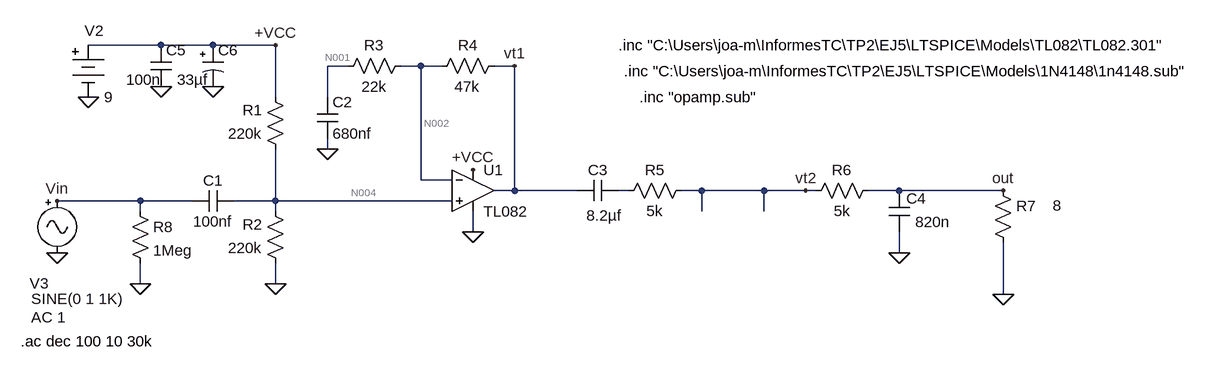
[diagram p0: schematic alternativa.asc]
alternativa.asc, the LTspice schematic file:
Version 4
SHEET 1 1528 680
WIRE -352 -80 -464 -80
WIRE -272 -80 -352 -80
WIRE -176 -80 -272 -80
WIRE -64 -48 -96 -48
WIRE 48 -48 16 -48
WIRE 80 -48 48 -48
WIRE 192 -48 160 -48
WIRE -176 0 -176 -80
WIRE -96 0 -96 -48
WIRE -96 80 -96 64
WIRE 48 128 48 -48
WIRE 96 128 48 128
WIRE 192 144 192 -48
WIRE 192 144 160 144
WIRE 288 144 192 144
WIRE 368 144 352 144
WIRE 480 144 448 144
WIRE 576 144 480 144
WIRE 640 144 576 144
WIRE 656 144 640 144
WIRE 784 144 736 144
WIRE 944 144 784 144
WIRE -384 160 -512 160
WIRE -304 160 -384 160
WIRE -176 160 -176 80
WIRE -176 160 -240 160
WIRE 96 160 -176 160
WIRE -384 176 -384 160
WIRE -176 176 -176 160
WIRE 480 176 480 144
WIRE 576 176 576 144
WIRE 128 208 128 176
WIRE 784 240 784 208
WIRE -384 288 -384 256
WIRE -176 288 -176 256
WIRE 944 304 944 224
FLAG -96 80 0
FLAG 784 240 0
FLAG 128 208 0
FLAG -176 288 0
FLAG -352 -16 0
FLAG -384 288 0
FLAG -512 240 0
FLAG -464 0 0
FLAG -512 160 Vin
FLAG -176 -80 +VCC
FLAG 128 112 +VCC
FLAG -272 -16 0
FLAG 192 -48 vt1
FLAG 640 144 vt2
FLAG 944 304 0
FLAG 944 144 out
SYMBOL res -160 96 R180
WINDOW 0 36 76 Left 2
WINDOW 3 36 40 Left 2
SYMATTR InstName R1
SYMATTR Value 220k
SYMBOL res -160 272 R180
WINDOW 0 36 76 Left 2
WINDOW 3 36 40 Left 2
SYMATTR InstName R2
SYMATTR Value 220k
SYMBOL res -80 -32 R270
WINDOW 0 32 56 VTop 2
WINDOW 3 0 56 VBottom 2
SYMATTR InstName R3
SYMATTR Value 22k
SYMBOL res 176 -64 R90
WINDOW 0 0 56 VBottom 2
WINDOW 3 32 57 VTop 2
SYMATTR InstName R4
SYMATTR Value 47k
SYMBOL res 464 128 R90
WINDOW 0 0 56 VBottom 2
WINDOW 3 32 56 VTop 2
SYMATTR InstName R5
SYMATTR Value 5k
SYMBOL cap -240 144 R90
WINDOW 0 0 32 VBottom 2
WINDOW 3 32 32 VTop 2
SYMATTR InstName C1
SYMATTR Value 100nf
SYMBOL cap 768 144 R0
WINDOW 0 27 12 Left 2
WINDOW 3 41 48 Left 2
SYMATTR InstName C4
SYMATTR Value 820n
SYMBOL res -400 160 R0
SYMATTR InstName R8
SYMATTR Value 1Meg
SYMBOL Misc\\battery -464 -96 R0
WINDOW 123 0 0 Left 2
WINDOW 39 0 0 Left 2
WINDOW 0 -6 -6 Left 2
SYMATTR InstName V2
SYMATTR Value 9
SYMBOL Misc\\signal -512 144 R0
WINDOW 123 -40 195 Left 2
WINDOW 39 0 0 Left 2
WINDOW 0 -42 143 Left 2
WINDOW 3 -40 167 Left 2
SYMATTR Value2 AC 1
SYMATTR InstName V3
SYMBOL res 752 128 R90
WINDOW 0 0 56 VBottom 2
WINDOW 3 32 56 VTop 2
SYMATTR InstName R6
SYMATTR Value 5k
SYMBOL cap -368 -80 R0
WINDOW 3 -38 53 Left 2
SYMATTR Value 100n
SYMATTR InstName C5
SYMBOL polcap -288 -80 R0
WINDOW 3 -39 53 Left 2
SYMATTR Value 33µf
SYMATTR InstName C6
SYMBOL res 928 128 R0
WINDOW 3 92 39 Left 2
SYMATTR Value 8
SYMATTR InstName R7
SYMBOL cap -112 0 R0
SYMATTR InstName C2
SYMATTR Value 680nf
SYMBOL Opamps\\opamp2 128 80 R0
SYMATTR InstName U1
SYMATTR Value TL082
SYMATTR SpiceModel TL082
SYMBOL cap 352 128 R90
WINDOW 0 0 32 VBottom 2
WINDOW 3 39 22 VTop 2
SYMATTR InstName C3
SYMATTR Value 8.2µf
TEXT 352 -80 Left 2 !.inc "C:\\Users\\joa-m\\InformesTC\\TP2\\EJ5\\LTSPICE\\Models\\TL082\\TL082.301"
TEXT 360 -40 Left 2 !.inc "C:\\Users\\joa-m\\InformesTC\\TP2\\EJ5\\LTSPICE\\Models\\1N4148\\1n4148.sub"
TEXT 384 0 Left 2 !.inc "opamp.sub"
TEXT -568 376 Left 2 !.ac dec 100 10 30k

The netlist it stands for:
* alternativa.asc
R1 N004 +VCC 220k
R2 0 N004 220k
R3 N001 N002 22k
R4 vt1 N002 47k
R5 vt2 N003 5k
C1 N004 Vin 100nf
C4 out 0 820n
R8 Vin 0 1Meg
V2 +VCC 0 9
V3 Vin 0 SINE(0 1 1K) AC 1
R6 out vt2 5k
C5 +VCC 0 100n
C6 +VCC 0 33µf
R7 out 0 8
C2 N001 0 680nf
XU1 N004 N002 +VCC 0 vt1 TL082 TL082  ; pins In+ In- V+ V- OUT
C3 N003 vt1 8.2µf
.inc "C:\Users\joa-m\InformesTC\TP2\EJ5\LTSPICE\Models\TL082\TL082.301"
.inc "C:\Users\joa-m\InformesTC\TP2\EJ5\LTSPICE\Models\1N4148\1n4148.sub"
.inc "opamp.sub"
.ac dec 100 10 30k
.backanno
.end

* Results of the author's LTspice run, read from the files saved beside the schematic
* Operating Point, zero values left out:
*   V(n004) = 4.5 V
*   V(+vcc) = 9 V
*   V(n001) = 4.5 V
*   V(n002) = 4.5 V
*   V(vt1) = 4.5 V
*   I(R4) = 34.55 pA
*   I(R2) = -20.45 µA
*   I(R1) = -20.45 µA
*   I(V2) = -4.415 mA
*   Ix(u1:1) = 34.55 pA
*   Ix(u1:2) = 34.55 pA
*   Ix(u1:3) = 4.395 mA
*   Ix(u1:4) = -4.395 mA
*   Ix(u1:5) = -34.55 pA
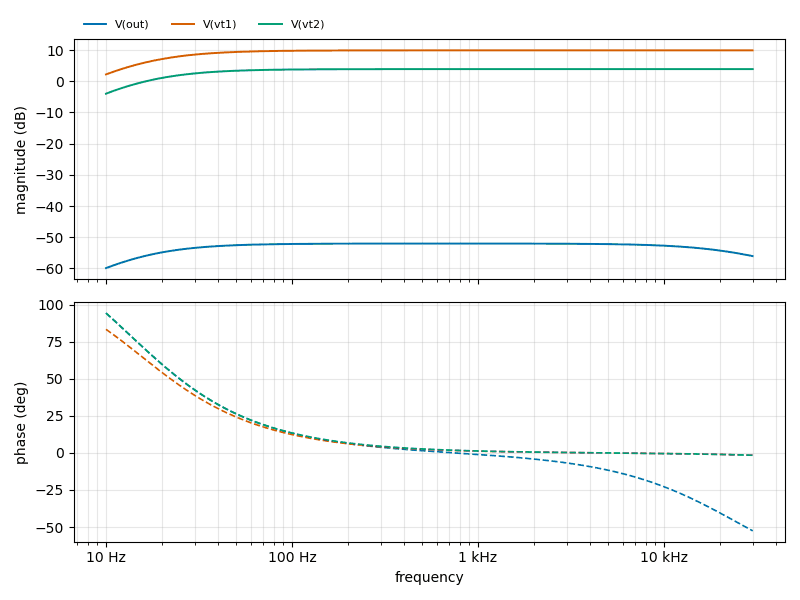
[diagram p1: AC Analysis of alternativa.asc, plotted from the saved traces]
* AC Analysis, 1 run:
*   V(out): -59.90 dB at 10 Hz, -56.04 dB at 30 kHz, peak -52.02 dB at 660.7 Hz, 3 dB below the peak at 19.24 Hz and 24.31 kHz
*   V(vt1): 2.21 dB at 10 Hz, 9.93 dB at 30 kHz, peak 9.93 dB at 4.786 kHz, 3 dB below the peak at 19.09 Hz
*   V(vt2): -3.96 dB at 10 Hz, 3.91 dB at 30 kHz, peak 3.91 dB at 3.162 kHz, 3 dB below the peak at 19.26 Hz